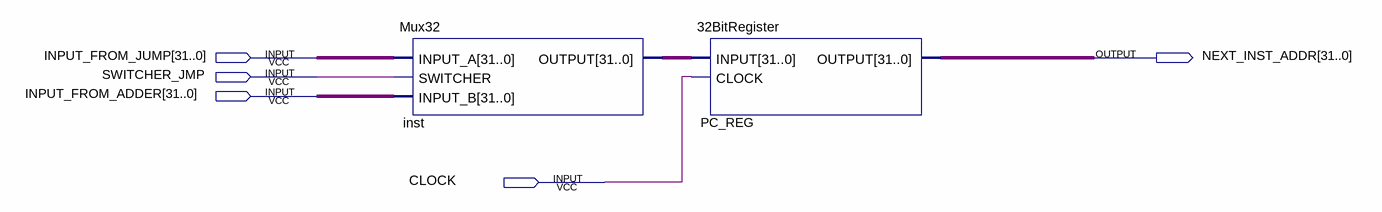
[diagram p0: schematic sheet]
// Quartus schematic ProgramCounter.bdf as structural Verilog: 2 symbols, 5 pins
module ProgramCounter (
  input  [31:0] INPUT_FROM_JUMP,
  input  SWITCHER_JMP,
  input  [31:0] INPUT_FROM_ADDER,
  input  CLOCK,
  output [31:0] NEXT_INST_ADDR
);

  wire [31:0] inst_output;

  Mux32 inst (.INPUT_A(INPUT_FROM_JUMP), .SWITCHER(SWITCHER_JMP), .INPUT_B(INPUT_FROM_ADDER), .OUTPUT(inst_output));
  \32BitRegister  PC_REG (.INPUT(inst_output), .CLOCK(CLOCK), .OUTPUT(NEXT_INST_ADDR));
endmodule
